# EAGLE design 2AFADC (EAGLE 7.1.0)
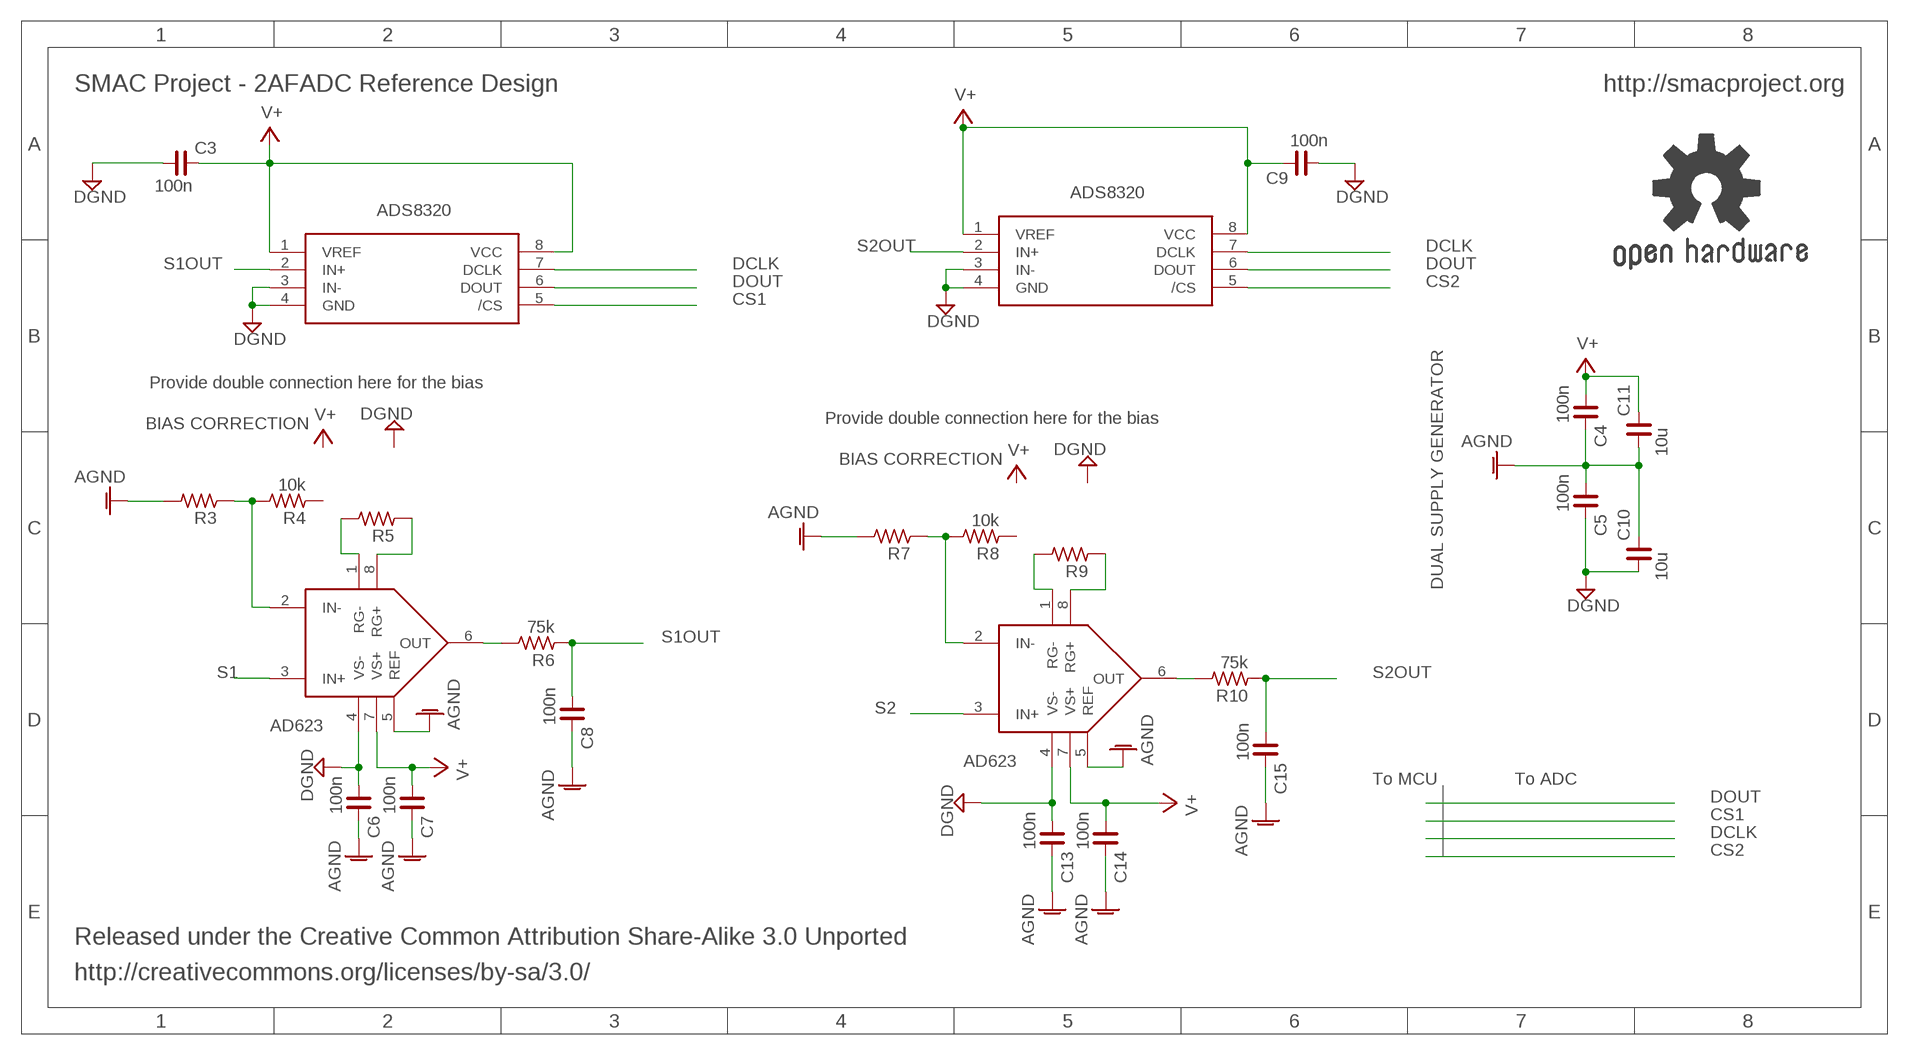
[diagram p0: schematic, sheet 1]

## Parts
C3  100n  C_0402  [C0402]
C4  100n  C_0402  [C0402]
C5  100n  C_0402  [C0402]
C6  100n  C_0402  [C0402]
C7  100n  C_0402  [C0402]
C8  100n  C_0402  [C0402]
C9  100n  C_0402  [C0402]
C10  10u  C_0402  [C0402]
C11  10u  C_0402  [C0402]
C13  100n  C_0402  [C0402]
C14  100n  C_0402  [C0402]
C15  100n  C_0402  [C0402]
GOLD_ORB_SM1  OSHWLOGO_REF_SM  [OSHW2REF]
R3  R_0402  [R0402]
R4  10k  R_0402  [R0402]
R5  R_0402  [R0402]
R6  75k  R_0402  [R0402]
R7  R_0402  [R0402]
R8  10k  R_0402  [R0402]
R9  R_0402  [R0402]
R10  75k  R_0402  [R0402]
U$2  AD623MSOP8  [MSOP8]
U$3  AD623MSOP8  [MSOP8]
U$5  ADS8320MSOP8  [MSOP8]
U$6  ADS8320MSOP8  [MSOP8]

## Nets
AGND: C4.2 C5.1 C6.2 C7.2 C8.2 C10.2 C11.1 C13.2 C14.2 C15.2 R3.2 R7.2 U$2.5(REF) U$3.5(REF)
CS1: U$5.5(/CS)
CS2: U$6.5(/CS)
DCLK: U$5.7(DCLK) U$6.7(DCLK)
DGND: C3.1 C5.2 C6.1 C9.1 C10.1 C13.1 U$2.4(VS-) U$3.4(VS-) U$5.3(IN-) U$5.4(GND) U$6.3(IN-) U$6.4(GND)
DOUT: U$5.6(DOUT) U$6.6(DOUT)
N$5: R3.1 R4.2 U$3.2(IN-)
N$6: R5.2 U$3.1(RG-)
N$7: R5.1 U$3.8(RG+)
N$8: R6.2 U$3.6(OUT)
N$11: R9.2 U$2.1(RG-)
N$12: R9.1 U$2.8(RG+)
N$13: R10.2 U$2.6(OUT)
N$38: R7.1 R8.2 U$2.2(IN-)
S1: U$3.3(IN+)
S1OUT: C8.1 R6.1 U$5.2(IN+)
S2: U$2.3(IN+)
S2OUT: C15.1 R10.1 U$6.2(IN+)
V+: C3.2 C4.1 C7.1 C9.2 C11.2 C14.1 U$2.7(VS+) U$3.7(VS+) U$5.1(VREF) U$5.8(VCC) U$6.1(VREF) U$6.8(VCC)
Unconnected: R4.1 R8.1

## Notes on the sheet
- SMAC Project - 2AFADC Reference Design | http://smacproject.org
- Provide double connection here for the bias
- Provide double connection here for the bias
- BIAS CORRECTION
- BIAS CORRECTION
- DUAL SUPPLY GENERATOR
- To MCU | To ADC
- Released under the Creative Common Attribution Share-Alike 3.0 Unported
- http://creativecommons.org/licenses/by-sa/3.0/

## Library data of the parts
C3-C11 C13-C15 = rc-master-smd:C_: NON-POLARIZED CAP
GOLD_ORB_SM1 = bfl:OSHWLOGO: These are Open-Source Hardware logos.
R3-R10 = rc-master-smd:R_: RESISTOR
U$2 U$3 = ad623:AD623
U$5 U$6 = ads8320:ADS8320

## Board
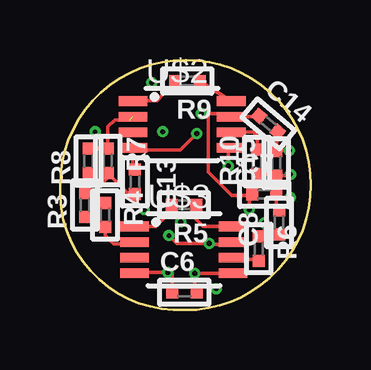
[diagram p1: board, top side]
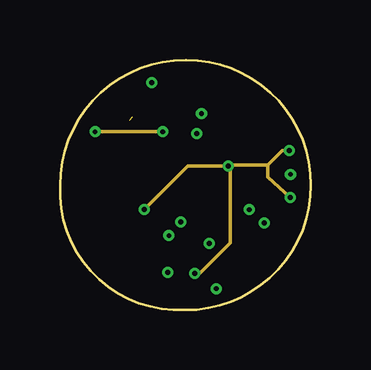
[diagram p2: board, inner layer Route2]
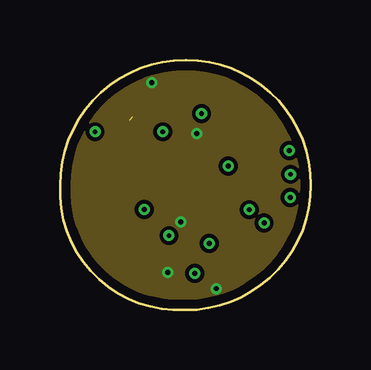
[diagram p3: board, inner layer Route15]
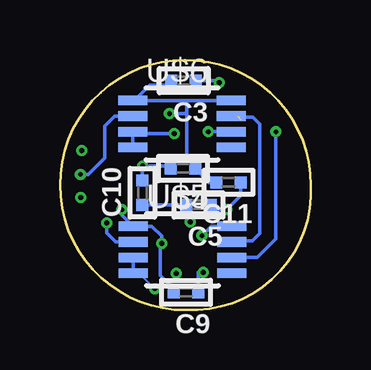
[diagram p4: board, bottom side, seen from below]

Size 10.46 x 10.44 mm. Coordinates in mm from the lower left corner, seen from the top.
Outline: 0,5.21 arc-90 5.23,10.44 5.26,10.44 arc-90 10.46,5.23 arc-90 5.21,0 arc-95 0,5.22
Copper layers (1*2*15*16): Top 0.035mm / dielectric 0.1mm / Route2 0.035mm / dielectric 0.1mm / Route15 0.035mm / dielectric 0.1mm / Bottom 0.035mm
Design rules "4default *": minimum track width 0.1mm, minimum drill 0.1mm, track to track 0.16mm, track to pad 0.16mm, pad to pad 0.15mm, via to via 0.15mm, smd to smd 0.15mm, copper to edge 15mil, drill to drill 15mil, minimum pad ring 0.13mm, minimum via ring 0.13mm, stop-mask expansion 0.015mm, vias tented up to drill 0.15mm, thermal gap 10mil

### Footprints (pad centres in the part's own frame; a part is rotated, then mirrored left to right if it is on the bottom)
C0402 = smd 0.5 x 0.5: 1 -0.508,0; 2 0.508,0
R0402 = smd 0.5 x 0.5: 1 -0.508,0; 2 0.508,0
MSOP8 = smd 0.4 x 1.2: 1 -0.975,-2.05; 2 -0.325,-2.05; 3 0.325,-2.05; 4 0.975,-2.05; 5 0.975,2.05; 6 0.325,2.05; 7 -0.325,2.05; 8 -0.975,2.05

### Placement (x,y rotation side)
C3  5.3,9.57 180 bottom
C4  5.34,5.91 180 bottom
C5  4.69,4.39 180 bottom
C6  5.18,0.74 0 top
C7  8.51,4.83 0 top
C8  9.13,3.66 90 top
C9  5.21,0.74 180 bottom
C10  7.02,4.9 90 bottom
C11  3.44,5.33 180 bottom
C13  3.12,5.35 270 top
C14  8.69,7.77 320 top
C15  9.01,6.13 90 top
GOLD_ORB_SM1  11.56,1.58 0 top
R3  1.04,4.39 90 top
R4  1.88,3.97 270 top
R5  5.17,4.39 180 top
R6  8.28,2.56 270 top
R7  1.99,6.23 270 top
R8  1.19,6.22 90 top
R9  5.31,9.56 180 top
R10  8.21,6.19 90 top
U$2  5.09,7.74 270 top
U$3  5.16,2.51 270 top
U$5  5.35,2.52 270 bottom
U$6  5.38,7.77 270 bottom

### Tracks (layer width: path | path; a pad name or v marks a point on that pad's centre or on a via)
AGND  (via drill 0.2 pad 0.4)
  Top 0.1: 5.61,0.86 5.62,0.85
  Top 0.15: 7.09,6.72 U$2.5 7.01,6.77 v7.01,6.01 | 5.62,0.85 C6.2 | v3.51,4.19 3.12,4.58 C13.2 2.87,4.84 R7.2 | v9.56,6.65 9.31,6.65 C15.2 arc90 9.02,6.65 9.02,7.68 C14.2 | U$3.5 arc-90 7.13,1.46 7.06,1.53 v5.61,1.53 5.61,0.86 | C8.2 9.02,4.27 C7.2 arc90 9.15,4.7 v9.6,4.7 | R3.2 1.35,4.89 1.99,5.53 R7.2 | R7.2 2.06,5.73
  Route2 0.1: v7.01,6.01 7.12,6.05
  Route2 0.15: v3.51,4.19 5.33,6.01 v7.01,6.01 arc-90 7.08,5.94 7.08,2.8 5.82,1.53 v5.61,1.53 | 7.12,6.05 8.65,6.05 | 8.65,6.05 9.26,6.65 v9.56,6.65 | 8.65,6.05 8.65,5.55 v9.6,4.7
  Bottom 0.1: 4.01,4.19 C5.1 4.02,4.21 | C4.2 5.85,6.02
  Bottom 0.15: 4.01,4.19 v3.51,4.19 2.93,4.77 C11.1 | C4.2 5.83,6.01 v7.01,6.01 | v7.01,6.01 7.02,5.95 | C10.2 7.02,6 arc90 v7.01,6.01
CS2
  Bottom 0.15: U$6.5 3.11,6.79
DCLK
  Bottom 0.15: 3.01,8.09 U$6.7 3.28,8.05 2.42,8.05 2.13,7.76 2.13,3.2 2.45,2.88 3.27,2.88 U$5.7
DGND  (via drill 0.2 pad 0.4)
  Top 0.1: C13.1 3.04,5.94
  Top 0.13: 3.04,5.94 U$2.4 | v5.7,7.36 v5.7,7.35
  Top 0.15: v5.03,3.68 5.01,3.7 | 5.01,3.7 | C13.1 3.04,5.86 3.04,6.67 5.01,6.67 v5.7,7.36 | U$3.4 3.46,1.46 3.46,1.58 v4.49,1.58 4.67,1.58 C6.1
  Bottom 0.1: C5.2 5.03,4.2 | v6.51,0.89 7.13,1.51 U$5.4
  Bottom 0.15: U$6.3 U$6.4 7.43,7.36 v5.7,7.36 | U$5.3 U$5.4 7.21,1.48 | 5.03,4.2 v5.03,3.68 | 5.3,4.29 C5.2 C10.1 | v3.82,9.49 3.69,9.57 C3.1 | C9.1 4.7,1.58 v4.49,1.58
  pour Route15 (isolate 0.16): 0.17,4.92 0.17,5.22 arc-90 5.27,10.32 arc-90 10.37,5.21 arc-92 5.06,0.1 arc-84 0.12,4.9
DOUT  (via drill 0.2 pad 0.4)
  Route2 0.15: v4.28,7.44 4.27,7.42 4.25,7.44 v1.46,7.44
  Bottom 0.13: U$5.6 3.4,2.12
  Bottom 0.15: U$5.6 2.24,2.19 1.46,2.97 v1.46,7.44 | U$6.6 v4.28,7.44
N$5
  Top 0.15: R3.1 1.46,3.46 R4.2 1.88,3.12 2.25,2.75 3.11,2.75 U$3.2
N$6
  Top 0.15: 4.54,4.28 R5.2 4.66,4.15 3.99,3.49 U$3.1
N$7
  Top 0.15: U$3.8 5.96,3.49 5.67,3.78 5.67,4.39 R5.1
N$8
  Top 0.15: R6.2 8.17,2.11 7.21,2.11 U$3.6
N$11
  Top 0.15: U$2.1 3.05,8.73 4.05,8.73 R9.2
N$12
  Top 0.15: R9.1 U$2.8
N$13
  Top 0.15: R10.2 8.21,7.26 8.05,7.42 U$2.6
N$38  (1 unrouted)
  Top 0.1: R8.2 1.02,6.79 1.07,6.74
  Top 0.15: R7.1 1.91,6.79 | R7.1 1.07,6.74 | 2.9,7.93 2.28,7.93 1.99,7.65 R7.1
S1OUT  (via drill 0.2 pad 0.4)
  Top 0.15: v8.5,3.63 8.5,3.12 R6.1 8.59,3.03 9.13,3.03 C8.1
  Bottom 0.15: 7.52,2.74 U$5.2 8.13,2.84 8.5,3.22 v8.5,3.63
S2OUT  (via drill 0.2 pad 0.4)
  Top 0.15: R10.1 8.95,5.69 C15.1 9.56,5.62 v9.6,5.67
  Bottom 0.15: U$6.2 8.18,8.09 8.6,7.67 8.6,6.98 8.6,6.34 9.28,5.67 v9.6,5.67
V+  (via drill 0.2 pad 0.4)
  Top 0.1: C7.1 8.02,4.76 | U$2.7
  Top 0.15: U$3.7 6.66,2.74 6.25,2.74 arc-90 v6.22,2.78 4.86,2.78 v4.54,3.1 | U$2.7 8.22,8.07 arc90 C14.1 | U$2.7 7.14,8.2 v5.9,8.2 6.17,8.2 6.17,5.76 7.15,4.78 7.95,4.78 arc90 C7.1 arc90 7.89,4.71 v7.89,4.19
  Bottom 0.15: U$6.1 7.78,8.74 | 2.94,3.43 U$5.8 4.15,3.49 v4.54,3.1 | U$6.8 5.18,8.75 | C11.2 4.25,5.33 C4.1 5.18,6.41 5.18,8.2 | C9.2 5.7,0.71 5.7,0.87 6.27,1.44 6.27,2.73 v6.22,2.78 | U$6.1 7.43,8.72 | 5.83,9.57 C3.2 5.99,9.39 6.71,9.39 7.36,8.74 U$6.1 | v5.9,8.2 5.18,8.2 | 5.18,8.2 5.18,8.75 | 5.18,8.75 U$6.1 | v6.22,2.78 6.19,2.76 | U$5.1 6.93,3.49 | U$5.1 7.89,3.97 v7.89,4.19 | v6.22,2.78 6.22,2.79 6.22,3.09 6.63,3.49 U$5.1

### Text on the board
Reference: http://smacproject.org